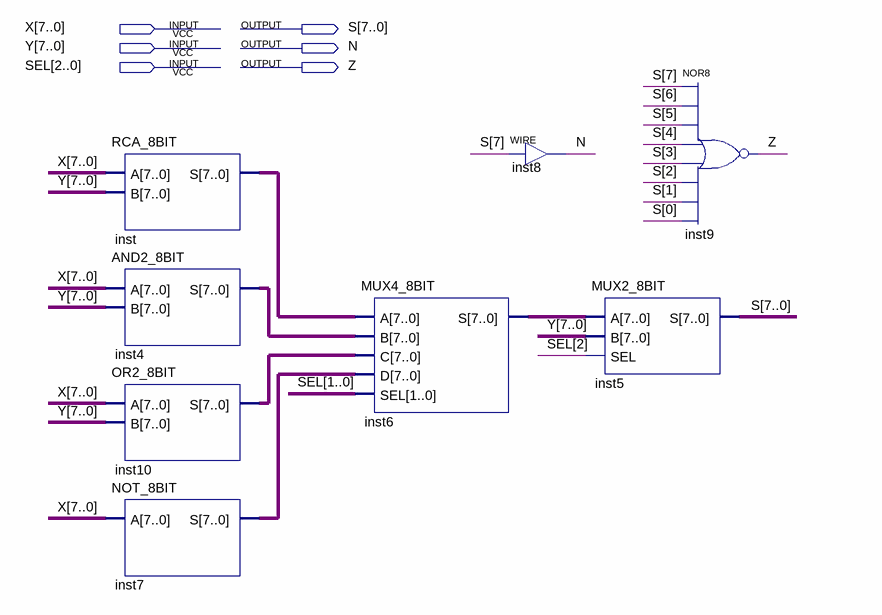
[diagram p0: schematic sheet]
// Quartus schematic ULA.bdf as structural Verilog: 8 symbols, 6 pins
module ULA (
  input  [7:0] X,
  input  [7:0] Y,
  input  [2:0] SEL,
  output [7:0] S,
  output N,
  output Z
);

  wire [7:0] inst4_s, inst6_s, inst7_s, inst10_s, inst_s;

  RCA_8BIT inst (.A(X), .B(Y), .S(inst_s));
  AND2_8BIT inst4 (.A(X), .B(Y), .S(inst4_s));
  OR2_8BIT inst10 (.A(X), .B(Y), .S(inst10_s));
  NOT_8BIT inst7 (.A(X), .S(inst7_s));
  MUX4_8BIT inst6 (.A(inst_s), .B(inst4_s), .C(inst10_s), .D(inst7_s), .SEL(SEL[1:0]), .S(inst6_s));
  assign N = S[7];  // WIRE inst8
  MUX2_8BIT inst5 (.A(inst6_s), .B(Y), .SEL(SEL[2]), .S(S));
  nor inst9 (Z, S[7], S[6], S[5], S[4], S[3], S[2], S[1], S[0]);
endmodule
